# EAGLE design neopixel_nano_strip (EAGLE 8.0.1)
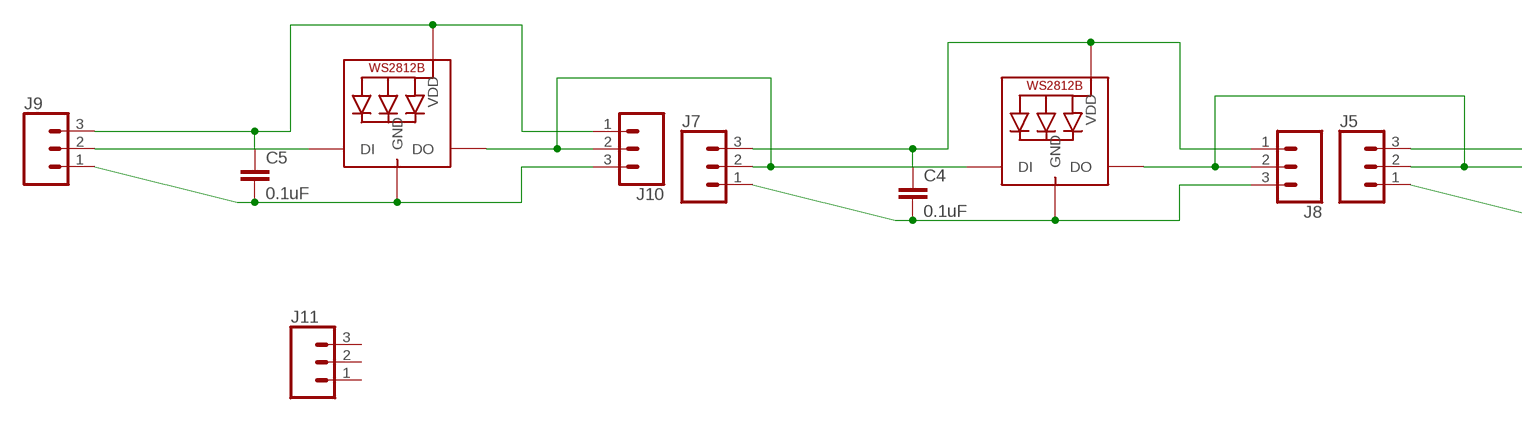
[diagram p0: schematic, sheet 1, part 1 of 2]
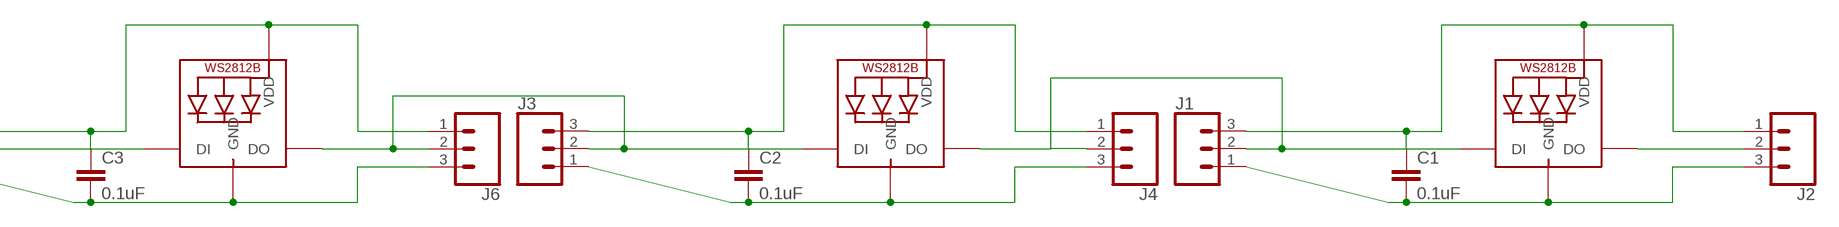
[diagram p1: schematic, sheet 1, part 2 of 2]

## Parts
C1  0.1uF  0.1UF-0603-25V-(+80/-20%)  [0603]
C2  0.1uF  0.1UF-0603-25V-(+80/-20%)  [0603]
C3  0.1uF  0.1UF-0603-25V-(+80/-20%)  [0603]
C4  0.1uF  0.1UF-0603-25V-(+80/-20%)  [0603]
C5  0.1uF  0.1UF-0603-25V-(+80/-20%)  [0603]
J1  CONN_031X03_NO_SILK  [1X03_NO_SILK]
J2  CONN_031X03_NO_SILK  [1X03_NO_SILK]
J3  CONN_031X03_NO_SILK  [1X03_NO_SILK]
J4  CONN_031X03_NO_SILK  [1X03_NO_SILK]
J5  CONN_031X03_NO_SILK  [1X03_NO_SILK]
J6  CONN_031X03_NO_SILK  [1X03_NO_SILK]
J7  CONN_031X03_NO_SILK  [1X03_NO_SILK]
J8  CONN_031X03_NO_SILK  [1X03_NO_SILK]
J9  CONN_031X03_NO_SILK  [1X03_NO_SILK]
J10  CONN_031X03_NO_SILK  [1X03_NO_SILK]
J11  CONN_031X03_NO_SILK  [1X03_NO_SILK]
LED1  WS2812BNANO  [NEOPIXEL_NANO]
LED2  WS2812BNANO  [NEOPIXEL_NANO]
LED3  WS2812BNANO  [NEOPIXEL_NANO]
LED4  WS2812BNANO  [NEOPIXEL_NANO]
LED5  WS2812BNANO  [NEOPIXEL_NANO]

## Nets
DIN4: J9.2 LED5.P$3(DI)
DOUT: J2.2 LED1.P$1(DO)
DOUT1: J1.2 J4.2 LED1.P$3(DI) LED2.P$1(DO)
DOUT2: J3.2 J6.2 LED2.P$3(DI) LED3.P$1(DO)
DOUT3: J5.2 J8.2 LED3.P$3(DI) LED4.P$1(DO)
DOUT4: J7.2 J10.2 LED4.P$3(DI) LED5.P$1(DO)
GND: C1.2 C2.2 C3.2 C4.2 C5.2 J1.1 J2.3 J3.1 J4.3 J5.1 J6.3 J7.1 J8.3 J9.1 J10.3 LED1.P$2(GND) LED2.P$2(GND) LED3.P$2(GND) LED4.P$2(GND) LED5.P$2(GND)
VCC: C1.1 C2.1 C3.1 C4.1 C5.1 J1.3 J2.1 J3.3 J4.1 J5.3 J6.1 J7.3 J8.1 J9.3 J10.1 LED1.P$4(VDD) LED2.P$4(VDD) LED3.P$4(VDD) LED4.P$4(VDD) LED5.P$4(VDD)
Unconnected: J11.1 J11.2 J11.3

## Library data of the parts
C1-C5 = SparkFun-Capacitors:0.1UF: 0.1µF ceramic capacitors A capacitor is a passive two-terminal electrical component used to store electrical energy temporarily in an electric field.; PROD_ID: CAP-00810
J1-J11 = SparkFun-Connectors:CONN_03: Multi connection point. Often used as Generic Header-pin footprint for 0.1 inch spaced/style header connections On any of the 0.1 inch spaced packages, you can populate with these: Break Away Headers - Straight <https://www.sparkfun.com/products/116> (PRT-00116) Break Away Male Headers - Right Angle <https://www.sparkfun.com/products/553> (PRT-00553) Female Headers <https://www.sparkfun.com/products/115> (PRT-00115) Break Away Headers - Machine Pin <https://www.sparkfun.com/products/117> (PRT-00117) Break Away Female Headers - Swiss Machine Pin <https://www.sparkfun.com/products/743> (PRT-00743) Stackable Header - 3 Pin (Female, 0.1") <https://www.sparkfun.com/products/13875> (PRT-13875) For SCREWTERMINALS and SPRING TERMINALS visit here: Screw Terimnals on SparkFun.com <https://www.sparkfun.com/search/results?term=Screw+Terminals> (5mm/3.5mm/2.54mm spacing) This device is also useful as a general connection point to wire up your design to another part of your project. Our various solder wires solder well into these plated through hole pads. Hook-Up Wire - Assortment (Stranded, 22 AWG) <https://www.sparkfun.com/products/11375> (PRT-11375) Hook-Up Wire - Assortment (Solid Core, 22 AWG) <https://www.sparkfun.com/products/11367> (PRT-11367) View the entire wire category on our website here <https://www.sparkfun.com/categories/141> Special notes: Molex polarized connector foot print use with SKU : PRT-08232 with associated crimp pins and housings.
LED1-LED5 = 00_bsiepert:WS2812B

## Board
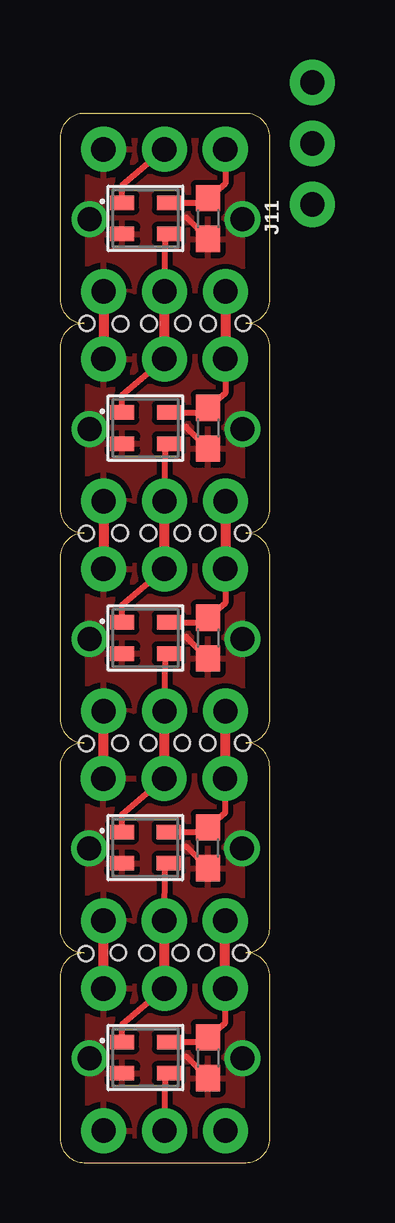
[diagram p2: board, top side]
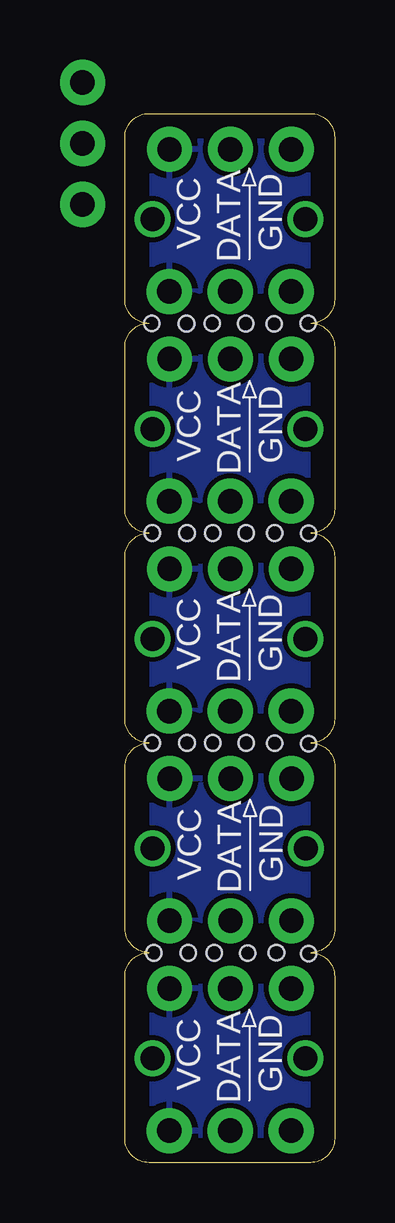
[diagram p3: board, bottom side, seen from below]

Size 8.76 x 43.73 mm. Coordinates in mm from the lower left corner, seen from the top.
Outline: 1.01,34.98 arc-90 0.01,35.98 0.01,42.73 arc-90 1.01,43.73 7.76,43.73 arc-90 8.76,42.73 8.76,35.98 arc-90 7.76,34.98
Outline: 7.76,34.99 arc-90 8.76,33.99 8.76,27.24 arc-90 7.76,26.24 arc-90 8.76,25.24 8.76,18.49 arc-90 7.76,17.49
Outline: 1.01,34.99 arc90 0.01,33.99 0.01,27.24 arc90 1.01,26.24 arc90 0.01,25.24 0.01,18.49 arc90 1.01,17.49
Outline: 1,8.75 arc-90 0,9.75 0,16.5 arc-90 1,17.5
Outline: 7.75,8.75 arc90 8.75,9.75 8.75,16.5 arc90 7.75,17.5
Outline: 7.76,8.75 arc-90 8.76,7.75 8.76,1 arc-90 7.76,0 1.01,0 arc-90 0.01,1 0.01,7.75 arc-90 1.01,8.75
Outline: 0.76,35.06 0.76,34.93
Outline: 8,35.02 8,34.94
Outline: 0.87,26.26 0.87,26.22
Outline: 7.9,26.26 7.9,26.22
Outline: 0.8,17.54 0.8,17.45
Outline: 7.95,17.53 7.95,17.46
Outline: 0.83,8.79 0.84,8.79 0.84,8.7
Outline: 7.95,8.8 7.95,8.68
Copper layers (1*16): Top 0.035mm / dielectric 1.5mm / Bottom 0.035mm
Design rules "default": minimum track width 10mil, minimum drill 24mil, track to track 8mil, track to pad 8mil, pad to pad 8mil, via to via 8mil, smd to smd 8mil, copper to edge 40mil, drill to drill 8mil, minimum pad ring 10mil, minimum via ring 8mil, stop-mask expansion 4mil, vias tented up to drill 0mil, thermal gap 10mil
Holes 0.64 mm at 1.12,34.98 3.72,34.97 2.53,34.96 5.12,34.98 6.19,34.97 7.64,34.98 1.1,26.23 3.7,26.24 2.51,26.24 5.1,26.24 6.17,26.24 7.62,26.24 1.1,17.46 3.7,17.49 2.51,17.48 5.1,17.49 6.17,17.49 7.62,17.49 1.09,8.71 3.63,8.73 2.44,8.75 5.03,8.74 6.11,8.74 7.55,8.74

### Footprints (pad centres in the part's own frame; a part is rotated, then mirrored left to right if it is on the bottom)
0603 = smd 1.1 x 1: 1 -0.85,0; 2 0.85,0
1X03_NO_SILK = drill 1.016 pad 1.88: 1 0,0; 2 2.54,0; 3 5.08,0
NEOPIXEL_NANO = smd 1 x 0.6: P$1 0.975,-0.65; P$2 0.975,0.65; P$3 -0.975,0.65; P$4 -0.975,-0.65

### Placement (x,y rotation side)
C1  6.18,39.35 270 top
C2  6.18,30.61 270 top
C3  6.18,21.86 270 top
C4  6.17,13.12 270 top
C5  6.18,4.37 270 top
J1  1.83,36.31 0 top
J2  6.9,42.24 180 top
J3  1.83,27.57 0 top
J4  6.9,33.5 180 top
J5  1.83,18.82 0 top
J6  6.9,24.75 180 top
J7  1.82,10.08 0 top
J8  6.89,16.01 180 top
J9  1.83,1.33 0 top
J10  6.9,7.26 180 top
J11  10.53,39.94 90 top
LED1  3.57,39.36 180 top
LED2  3.57,30.62 180 top
LED3  3.57,21.87 180 top
LED4  3.56,13.13 180 top
LED5  3.57,4.38 180 top

### Tracks (layer width: path | path; a pad name or v marks a point on that pad's centre or on a via)
DIN4
  Top 0.254: J9.2 4.4,3.62 LED5.P$3
DOUT
  Top 0.254: LED1.P$1 2.6,40.74 J2.2
DOUT1
  Top 0.254: LED2.P$1 2.6,32 J4.2 | J1.2 4.4,38.6 LED1.P$3
  Top 0.406: J4.2 J1.2
DOUT2
  Top 0.254: LED3.P$1 2.6,23.25 J6.2 | J3.2 4.4,29.86 LED2.P$3
  Top 0.406: J6.2 J3.2
DOUT3
  Top 0.254: LED4.P$1 2.58,14.51 J8.2 | J5.2 4.4,21.11 LED3.P$3
  Top 0.406: J8.2 4.37,16.01 J5.2
DOUT4
  Top 0.254: LED5.P$1 2.6,5.76 J10.2 | J7.2 4.39,12.37 LED4.P$3
  Top 0.406: J10.2 J7.2
GND  (via drill 1 pad 1.02)
  Top 0.254: C1.2 6.17,38.5 5.27,39.4 | C2.2 6.17,29.76 5.27,30.66 | C3.2 6.17,21.01 5.27,21.91 | C4.2 6.16,12.27 5.26,13.17 | C5.2 6.17,3.52 5.27,4.42
  Top 0.406: J10.3 J7.1 | J5.1 1.81,18.82 J8.3 | J3.1 1.82,27.57 J6.3 | J1.1 1.82,36.31 J4.3
  other vias: 1.23,39.32 7.61,39.32 1.23,30.58 7.61,30.58 1.23,21.83 7.61,21.83 1.22,13.09 7.6,13.09 1.23,4.34 7.61,4.34
  pour Top: 0.28,-1.68 9.94,-1.62 10.12,47.87 6.07,47.6 0.01,47.82 0.38,8.97
VCC
  Top 0.254: J2.1 6.9,40.81 C1.1 5.98,40.01 LED1.P$4 | J4.1 6.9,32.07 C2.1 5.98,31.27 LED2.P$4 | J6.1 6.9,23.32 C3.1 5.98,22.52 LED3.P$4 | J8.1 6.89,14.58 C4.1 5.97,13.78 LED4.P$4 | J10.1 6.9,5.83 C5.1 5.98,5.03 LED5.P$4
  Top 0.406: J10.1 J7.3 | J5.3 6.89,18.82 J8.1 | J3.3 6.9,27.57 J6.1 | J1.3 6.9,36.31 J4.1
  pour Bottom: -0.1,45.39 10.02,45.71 10.36,19.67 9.88,-1.43 0.03,-1.38

### Text on the board
bPlace: GND | DATA | VCC | GND | DATA | VCC | VCC | GND | DATA | GND | VCC | DATA | GND | VCC | DATA